# Altium project BAT-010.PrjPcb
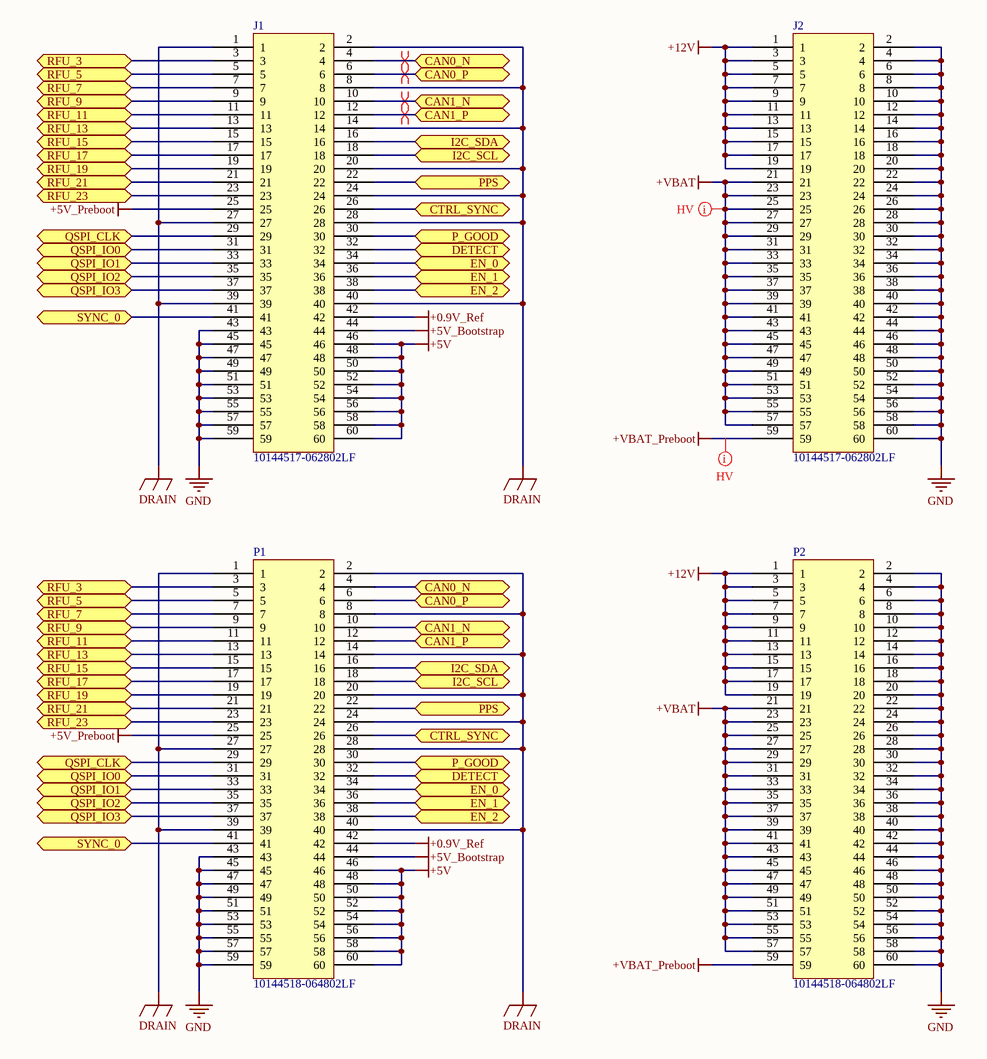
[diagram p0: Sheet1.SchDoc]
Title: Battery Board; SheetTotal: 2; Revision: A.1; Organization: Let's Build Rockets Inc.; DocumentNumber: BAT-010
2 sheets, 18 parts. Net scope: flat (ports and power ports of the same name join across sheets).
Board file: BAT-010.PcbDoc
Sheets:
  Sheet1.SchDoc
  Sheet2.SchDoc

## Sheet Sheet1.SchDoc: Battery Board
size B; Organization: Let's Build Rockets Inc.; DocumentNumber: BAT-010; Revision: A.1; SheetNumber: 1; SheetTotal: 2

### Parts
J1  10144517-062802LF  [10144517-062802LF]
J2  10144517-062802LF  [10144517-062802LF]
P1  10144518-064802LF  [10144518-064802LF]
P2  10144518-064802LF  [10144518-064802LF]

### Ports
CAN0_N (bidir), CAN0_P (bidir), CAN1_N (bidir), CAN1_P (bidir), CTRL_SYNC (bidir), DETECT (bidir), EN_0 (bidir), EN_1 (bidir), EN_2 (bidir), I2C_SCL (bidir), I2C_SDA (bidir), P_GOOD (bidir), PPS (bidir), QSPI_CLK (bidir), QSPI_IO0 (bidir), QSPI_IO1 (bidir), QSPI_IO2 (bidir), QSPI_IO3 (bidir), RFU_3 (bidir), RFU_5 (bidir), RFU_7 (bidir), RFU_9 (bidir), RFU_11 (bidir), RFU_13 (bidir), RFU_15 (bidir), RFU_17 (bidir), RFU_19 (bidir), RFU_21 (bidir), RFU_23 (bidir), SYNC_0 (bidir)

### Nets
+0.9V_Ref: J1.42 P1.42
+5V: J1.46 J1.48 J1.50 J1.52 J1.54 J1.56 J1.58 J1.60 P1.46 P1.48 P1.50 P1.52 P1.54 P1.56 P1.58 P1.60
+5V_Bootstrap: J1.44 P1.44
+5V_Preboot: J1.25 P1.25
+12V: J2.1 J2.3 J2.5 J2.7 J2.9 J2.11 J2.13 J2.15 J2.17 J2.19 P2.1 P2.3 P2.5 P2.7 P2.9 P2.11 P2.13 P2.15 P2.17 P2.19
+VBAT: J2.21 J2.23 J2.25 J2.27 J2.29 J2.31 J2.33 J2.35 J2.37 J2.39 J2.41 J2.43 J2.45 J2.47 J2.49 J2.51 J2.53 J2.55 J2.57 P2.21 P2.23 P2.25 P2.27 P2.29 P2.31 P2.33 P2.35 P2.37 P2.39 P2.41 P2.43 P2.45 P2.47 P2.49 P2.51 P2.53 P2.55 P2.57
+VBAT_Preboot: J2.59 P2.59
DRAIN: J1.1 J1.2 J1.8 J1.14 J1.20 J1.24 J1.27 J1.28 J1.39 J1.40 P1.1 P1.2 P1.8 P1.14 P1.20 P1.24 P1.27 P1.28 P1.39 P1.40
GND: J1.43 J1.45 J1.47 J1.49 J1.51 J1.53 J1.55 J1.57 J1.59 J2.2 J2.4 J2.6 J2.8 J2.10 J2.12 J2.14 J2.16 J2.18 J2.20 J2.22 J2.24 J2.26 J2.28 J2.30 J2.32 J2.34 J2.36 J2.38 J2.40 J2.42 J2.44 J2.46 J2.48 J2.50 J2.52 J2.54 J2.56 J2.58 J2.60 P1.43 P1.45 P1.47 P1.49 P1.51 P1.53 P1.55 P1.57 P1.59 P2.2 P2.4 P2.6 P2.8 P2.10 P2.12 P2.14 P2.16 P2.18 P2.20 P2.22 P2.24 P2.26 P2.28 P2.30 P2.32 P2.34 P2.36 P2.38 P2.40 P2.42 P2.44 P2.46 P2.48 P2.50 P2.52 P2.54 P2.56 P2.58 P2.60
CAN0_N: J1.4 P1.4 ; port CAN0_N
CAN0_P: J1.6 P1.6 ; port CAN0_P
CAN1_N: J1.10 P1.10 ; port CAN1_N
CAN1_P: J1.12 P1.12 ; port CAN1_P
CTRL_SYNC: J1.26 P1.26 ; port CTRL_SYNC
DETECT: J1.32 P1.32 ; port DETECT
EN_0: J1.34 P1.34 ; port EN_0
EN_1: J1.36 P1.36 ; port EN_1
EN_2: J1.38 P1.38 ; port EN_2
I2C_SCL: J1.18 P1.18 ; port I2C_SCL
I2C_SDA: J1.16 P1.16 ; port I2C_SDA
P_GOOD: J1.30 P1.30 ; port P_GOOD
PPS: J1.22 P1.22 ; port PPS
QSPI_CLK: J1.29 P1.29 ; port QSPI_CLK
QSPI_IO0: J1.31 P1.31 ; port QSPI_IO0
QSPI_IO1: J1.33 P1.33 ; port QSPI_IO1
QSPI_IO2: J1.35 P1.35 ; port QSPI_IO2
QSPI_IO3: J1.37 P1.37 ; port QSPI_IO3
RFU_3: J1.3 P1.3 ; port RFU_3
RFU_5: J1.5 P1.5 ; port RFU_5
RFU_7: J1.7 P1.7 ; port RFU_7
RFU_9: J1.9 P1.9 ; port RFU_9
RFU_11: J1.11 P1.11 ; port RFU_11
RFU_13: J1.13 P1.13 ; port RFU_13
RFU_15: J1.15 P1.15 ; port RFU_15
RFU_17: J1.17 P1.17 ; port RFU_17
RFU_19: J1.19 P1.19 ; port RFU_19
RFU_21: J1.21 P1.21 ; port RFU_21
RFU_23: J1.23 P1.23 ; port RFU_23
SYNC_0: J1.41 P1.41 ; port SYNC_0

### Layout directives
differential pair: CAN0_N, CAN0_P, CAN1_N, CAN1_P
net class HIghVoltage: +VBAT, +VBAT_Preboot

### Notes on the sheet
- Let's Build Rocket's Inc. Modular Paylaod System Based on TMP-010 Rev
  For more information visit https://github.com/LetsBuildRockets/Modular-Payload-System
  This work is licensed under CC BY-NC 4.0. To view a copy of this license, visit https://creativecommons.org/licenses/by-nc/4.0
- Title
- Size:
- Date:
- Assembly Variant:
- B
- Number:
- Time:
- Revision:
- Sheet
- of
- Author:
- File:

### Library data of the parts
J1 J2 = 10144517-062802LF: Unit Price (USD): 1.28
P1 P2 = 10144518-064802LF: Unit Price (USD): 1.52

## Sheet Sheet2.SchDoc: Battery Board
size B; Organization: Let's Build Rockets Inc.; DocumentNumber: BAT-010; Revision: A.1; SheetNumber: 2; SheetTotal: 2
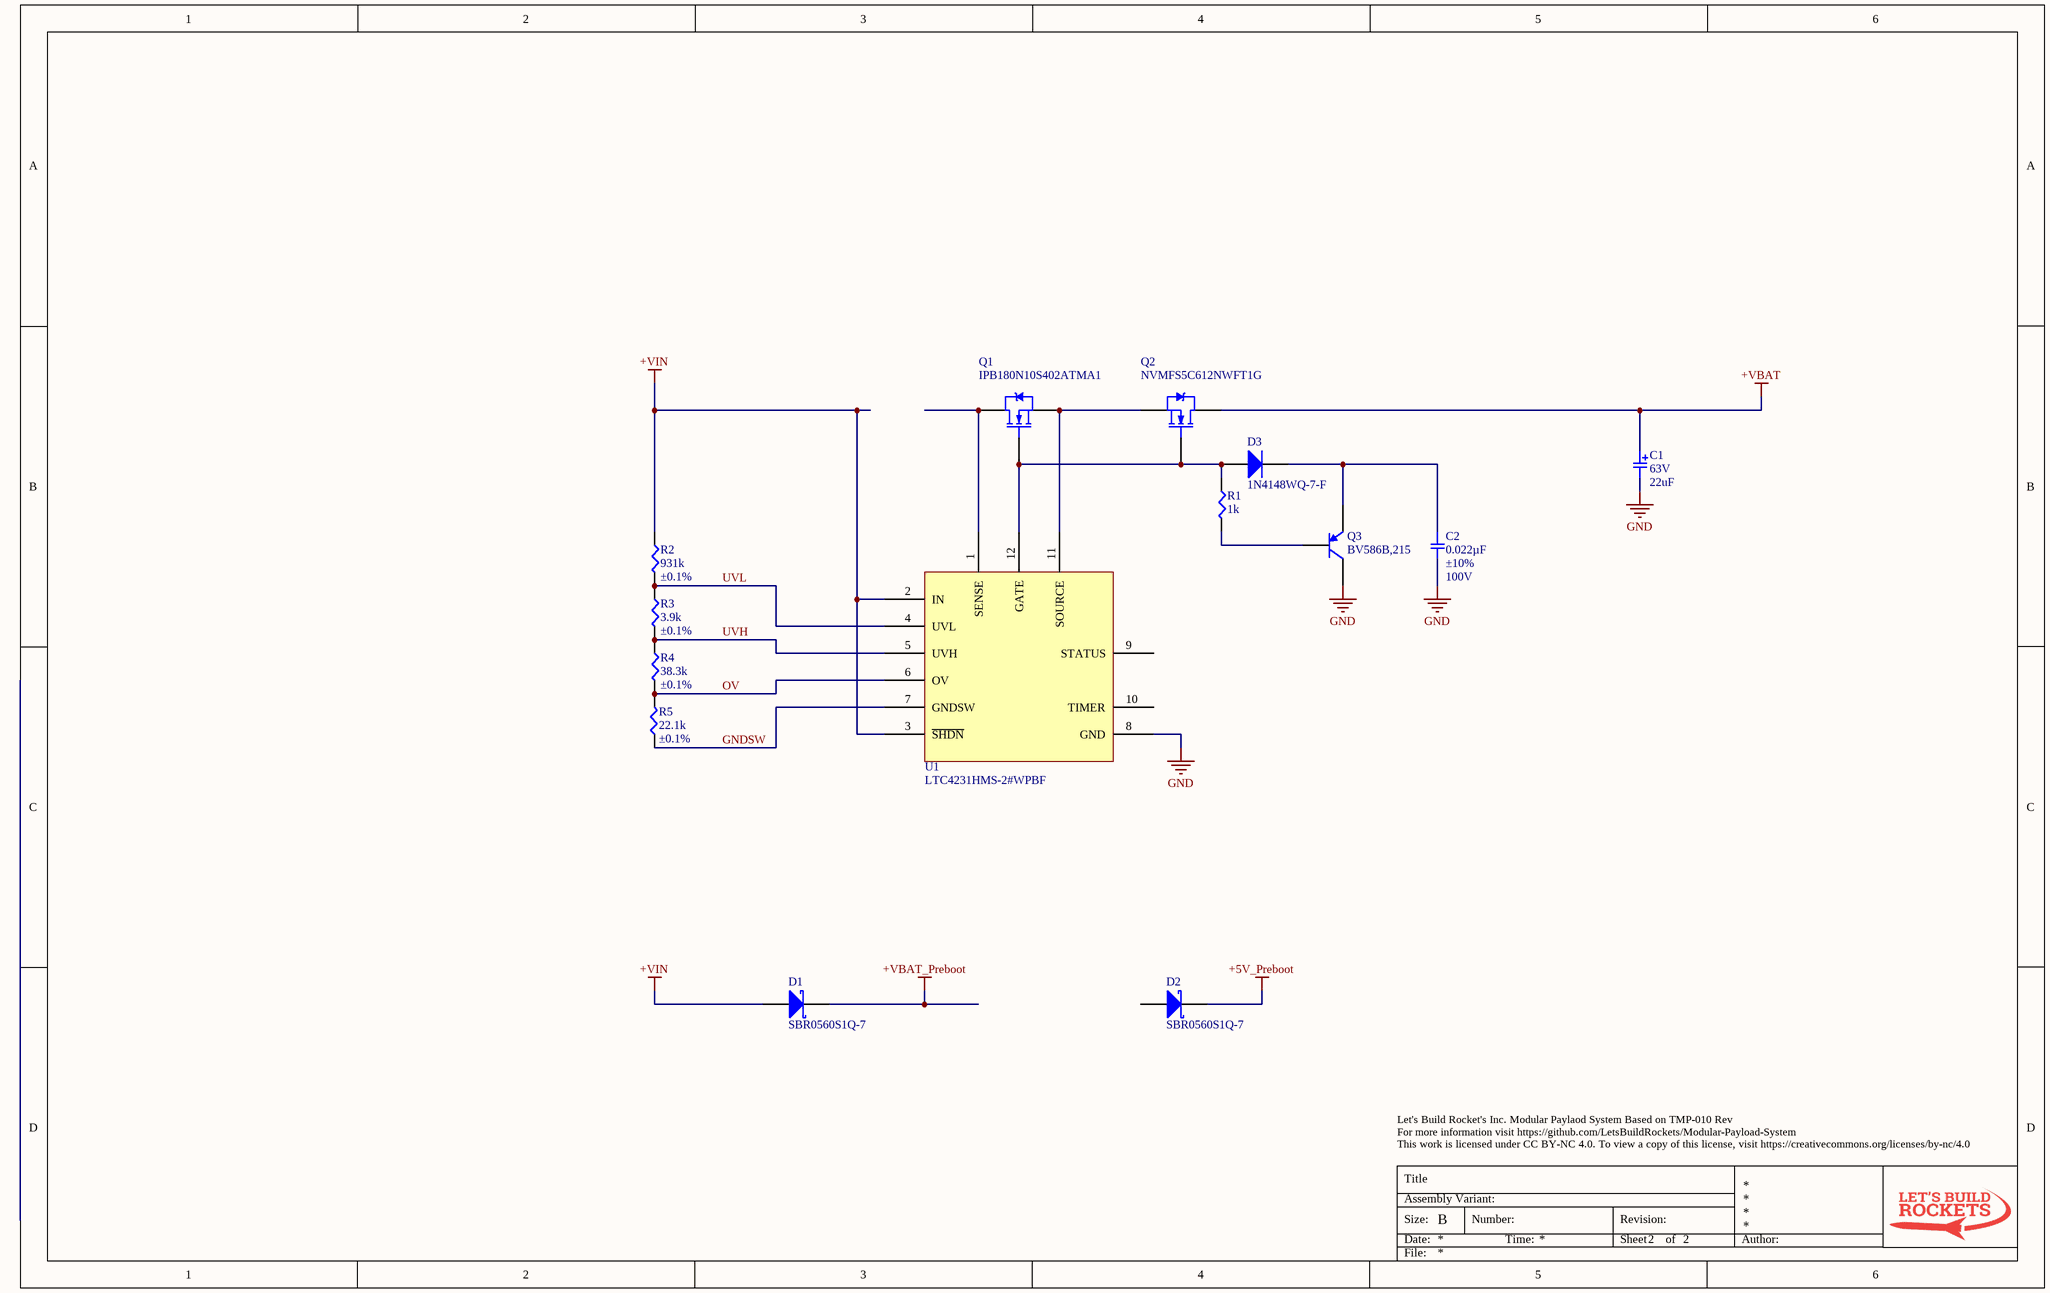
[diagram p1: Sheet2.SchDoc]

### Parts
C1  value 22uF  Voltage: 63V  [KEMET X - CAPMP7343X43N]  (hidden comment: T521X226M063ATE075)
C2  0.022µF  Tolerance: ±10%  Voltage: 100V  [SMD-0603C]
D1  SBR0560S1Q-7  [SOD123]
D2  SBR0560S1Q-7  [SOD123]
D3  1N4148WQ-7-F  [SOD123]
Q1  IPB180N10S402ATMA1  [DPAK127P1500X440-7N (PG-TO263-7-3)]
Q2  NVMFS5C612NWFT1G
Q3  BV586B,215
R1  1k  [SMD-0402-RES]
R2  931k  Tolerance: ±0.1%  [SMD-0805-RES]
R3  3.9k  Tolerance: ±0.1%  [SMD-0805-RES]
R4  38.3k  Tolerance: ±0.1%  [SMD-0805-RES]
R5  22.1k  Tolerance: ±0.1%  [SMD-0805-RES]
U1  LTC4231HMS-2#WPBF  [TSOP65P490X109-12N]

### Nets
+5V_Preboot: D2.K
+VBAT: C1.1 Q2.D
+VBAT_Preboot: D1.K
+VIN: D1.A R2.1 U1.2(IN) U1.3(~{SHDN})
GND: C1.2 C2.2 Q3.C U1.8(GND)
GNDSW: R5.1 U1.7(GNDSW)
OV: R4.2 R5.2 U1.6(OV)
UVH: R3.2 R4.1 U1.5(UVH)
UVL: R2.2 R3.1 U1.4(UVL)
NetC2_1: C2.1 D3.K Q3.E
NetD3_A: D3.A Q1.G Q2.G R1.1 U1.12(GATE)
NetQ1_D: Q1.D U1.1(SENSE)
NetQ1_S: Q1.S Q2.S U1.11(SOURCE)
NetQ3_B: Q3.B R1.2

Not connected (* = marked no-connect by the designer): D2 A; U1 9(STATUS) 10(TIMER)

### Notes on the sheet
- Let's Build Rocket's Inc. Modular Paylaod System Based on TMP-010 Rev
  For more information visit https://github.com/LetsBuildRockets/Modular-Payload-System
  This work is licensed under CC BY-NC 4.0. To view a copy of this license, visit https://creativecommons.org/licenses/by-nc/4.0
- Title
- Size:
- Date:
- Assembly Variant:
- B
- Number:
- Time:
- Revision:
- Sheet
- of
- Author:
- File:

### Library data of the parts
C1 = T521X226M063ATE075: ESR: 75mohm; Unit Price (USD): 7.09
C2 = GCJ188R72A223KA01D: CAP CER 0.022UF 100V X7R 0603; Manufacturer: Murata Electronics North America; Factory Stock: 0; Unit Price (USD): 0.26; Minimum Quantity: 1; Datasheets: http://www.murata.com/~/media/webrenewal/support/library/catalog/products/capacitor/mlcc/c03e.ashx; Image: //media.digikey.com/Renders/Murata%20Renders/0603%28LQG18%29.jpg; Digi-Key Part Number: 490-5769-1-ND; Part Number: GCJ188R72A223KA01D; Quantity Available: 40437; @ qty: 0; Packaging: Cut Tape (CT); Series: GCJ; Part Status: Active; Value: 0.022µF; Temperature Coefficient: X7R; Operating Temperature: -55°C ~ 125°C; Features: Soft Termination; Ratings: AEC-Q200; Applications: Automotive, Boardflex Sensitive; Mounting Type: Surface Mount, MLCC; Package / Case: 0603 (1608 Metric); Size / Dimension: 0.063" L x 0.031" W (1.60mm x 0.80mm); Height - Seated (Max): -; Thickness (Max): 0.031" (0.80mm); Lead Spacing: -; Lead Style: -
D1 D2 = SBR0560S1Q-7: Unit Price (USD): 0.37
D3 = 1N4148WQ-7-F: Unit Price (USD): 0.19
Q1 = IPB180N10S402ATMA1: Rds: 2.5mohm; Vgs: 20V; Power Dissipation: 300W; Id: 180A; VDS: 100V; Qg: 200nC; Ciss: 14600pF; Unit Price (USD): 5.65; Operating Temperature: -55°C ~ 175°C
Q2 = NVMFS5C612NWFT1G: Rds: 1.65mohm; Vgs: 20V; Power Dissipation: 3.8W; Id: 34A; VDS: 60V; Qg: 62nC; Ciss: 4900pF; Unit Price (USD): 2.19; Operating Temperature: -55°C ~ 175°C
R1 = ERJ-2GEJ102X: RES SMD 1K OHM 5% 1/10W 0402; Manufacturer: Panasonic Electronic Components; Factory Stock: 0; Unit Price (USD): 0.00350; @ qty: 1500; Minimum Quantity: 1; Power (Watts): 0.1W, 1/10W; Temperature Coefficient: ±200ppm/°C; Part Number: ERJ-2GEJ102X; Datasheets: http://industrial.panasonic.com/www-cgi/jvcr13pz.cgi?E+PZ+3+AOA0001+ERJ2GEJ102X+7+WW; Image: //media.digikey.com/Photos/Panasonic%20Photos/ERJ-PA2-Series.jpg; Digi-Key Part Number: P1.0KJCT-ND; Quantity Available: 1939857; Packaging: Cut Tape (CT); Series: ERJ; Part Status: Active; Value: 1k; Tolerance: ±5%; Composition: Thick Film; Features: Automotive AEC-Q200; Operating Temperature: -55°C ~ 155°C; Package / Case: 0402 (1005 Metric); Supplier Device Package: 0402; Size / Dimension: 0.039" L x 0.020" W (1.00mm x 0.50mm); Height - Seated (Max): 0.016" (0.40mm); Number of Terminations: 2; Failure Rate: -
R2 = ERJ-PB6B9313V: RES SMD 931K OHM 0.1% 1/4W 0805; Manufacturer: Panasonic Electronic Components; Factory Stock: 0; Unit Price (USD): 0.04554; @ qty: 1000; Minimum Quantity: 1; Power (Watts): 0.25W, 1/4W; Temperature Coefficient: ±50ppm/°C; Part Number: ERJ-PB6B9313V; Datasheets: https://industrial.panasonic.com/cdbs/www-data/pdf/RDA0000/AOA0000C100.pdf; Image: //media.digikey.com/Renders/Panasonic%20Renders/ERJ-0805%20Pkg.jpg; Digi-Key Part Number: P20933CT-ND; Quantity Available: 10000; Packaging: Cut Tape (CT); Series: ERJ; Part Status: Active; Value: 931k; Composition: Thick Film; Features: Automotive AEC-Q200, Pulse Withstanding; Operating Temperature: -55°C ~ 155°C; Package / Case: 0805 (2012 Metric); Supplier Device Package: 0805; Size / Dimension: 0.079" L x 0.049" W (2.00mm x 1.25mm); Height - Seated (Max): 0.028" (0.70mm); Number of Terminations: 2; Failure Rate: -
R3 = ERJ-PB6B3901V: RES SMD 3.9K OHM 0.1% 1/4W 0805; Manufacturer: Panasonic Electronic Components; Factory Stock: 0; Unit Price (USD): 0.04554; @ qty: 1000; Minimum Quantity: 1; Power (Watts): 0.25W, 1/4W; Temperature Coefficient: ±50ppm/°C; Part Number: ERJ-PB6B3901V; Datasheets: https://industrial.panasonic.com/cdbs/www-data/pdf/RDA0000/AOA0000C100.pdf; Image: //media.digikey.com/Renders/Panasonic%20Renders/ERJ-0805%20Pkg.jpg; Digi-Key Part Number: P20660CT-ND; Quantity Available: 10000; Packaging: Cut Tape (CT); Series: ERJ; Part Status: Active; Value: 3.9k; Composition: Thick Film; Features: Automotive AEC-Q200, Pulse Withstanding; Operating Temperature: -55°C ~ 155°C; Package / Case: 0805 (2012 Metric); Supplier Device Package: 0805; Size / Dimension: 0.079" L x 0.049" W (2.00mm x 1.25mm); Height - Seated (Max): 0.028" (0.70mm); Number of Terminations: 2; Failure Rate: -
R4 = ERJ-PB6B3832V: RES SMD 38.3K OHM 0.1% 1/4W 0805; Manufacturer: Panasonic Electronic Components; Factory Stock: 0; Unit Price (USD): 0.04554; @ qty: 1000; Minimum Quantity: 1; Power (Watts): 0.25W, 1/4W; Temperature Coefficient: ±50ppm/°C; Part Number: ERJ-PB6B3832V; Datasheets: https://industrial.panasonic.com/cdbs/www-data/pdf/RDA0000/AOA0000C100.pdf; Image: //media.digikey.com/Renders/Panasonic%20Renders/ERJ-0805%20Pkg.jpg; Digi-Key Part Number: P20773CT-ND; Quantity Available: 10000; Packaging: Cut Tape (CT); Series: ERJ; Part Status: Active; Value: 38.3k; Composition: Thick Film; Features: Automotive AEC-Q200, Pulse Withstanding; Operating Temperature: -55°C ~ 155°C; Package / Case: 0805 (2012 Metric); Supplier Device Package: 0805; Size / Dimension: 0.079" L x 0.049" W (2.00mm x 1.25mm); Height - Seated (Max): 0.028" (0.70mm); Number of Terminations: 2; Failure Rate: -
R5 = ERJ-PB6B2212V: RES SMD 22.1K OHM 0.1% 1/4W 0805; Manufacturer: Panasonic Electronic Components; Factory Stock: 0; Unit Price (USD): 0.04554; @ qty: 1000; Minimum Quantity: 1; Power (Watts): 0.25W, 1/4W; Temperature Coefficient: ±50ppm/°C; Part Number: ERJ-PB6B2212V; Datasheets: https://industrial.panasonic.com/cdbs/www-data/pdf/RDA0000/AOA0000C100.pdf; Image: //media.digikey.com/Renders/Panasonic%20Renders/ERJ-0805%20Pkg.jpg; Digi-Key Part Number: P20745CT-ND; Quantity Available: 10000; Packaging: Cut Tape (CT); Series: ERJ; Part Status: Active; Value: 22.1k; Composition: Thick Film; Features: Automotive AEC-Q200, Pulse Withstanding; Operating Temperature: -55°C ~ 155°C; Package / Case: 0805 (2012 Metric); Supplier Device Package: 0805; Size / Dimension: 0.079" L x 0.049" W (2.00mm x 1.25mm); Height - Seated (Max): 0.028" (0.70mm); Number of Terminations: 2; Failure Rate: -
U1 = LTC4231HMS-2#WPBF: Unit Price (USD): 8.24

## Nets that join several sheets
+5V_Preboot: Sheet1 (J1.25 P1.25), Sheet2 (D2.K)
+VBAT: Sheet1 (38 pins), Sheet2 (C1.1 Q2.D)
+VBAT_Preboot: Sheet1 (J2.59 P2.59), Sheet2 (D1.K)
GND: Sheet1 (78 pins), Sheet2 (C1.2 C2.2 Q3.C U1.8)